# EAGLE design main1 (EAGLE 7.5.0)
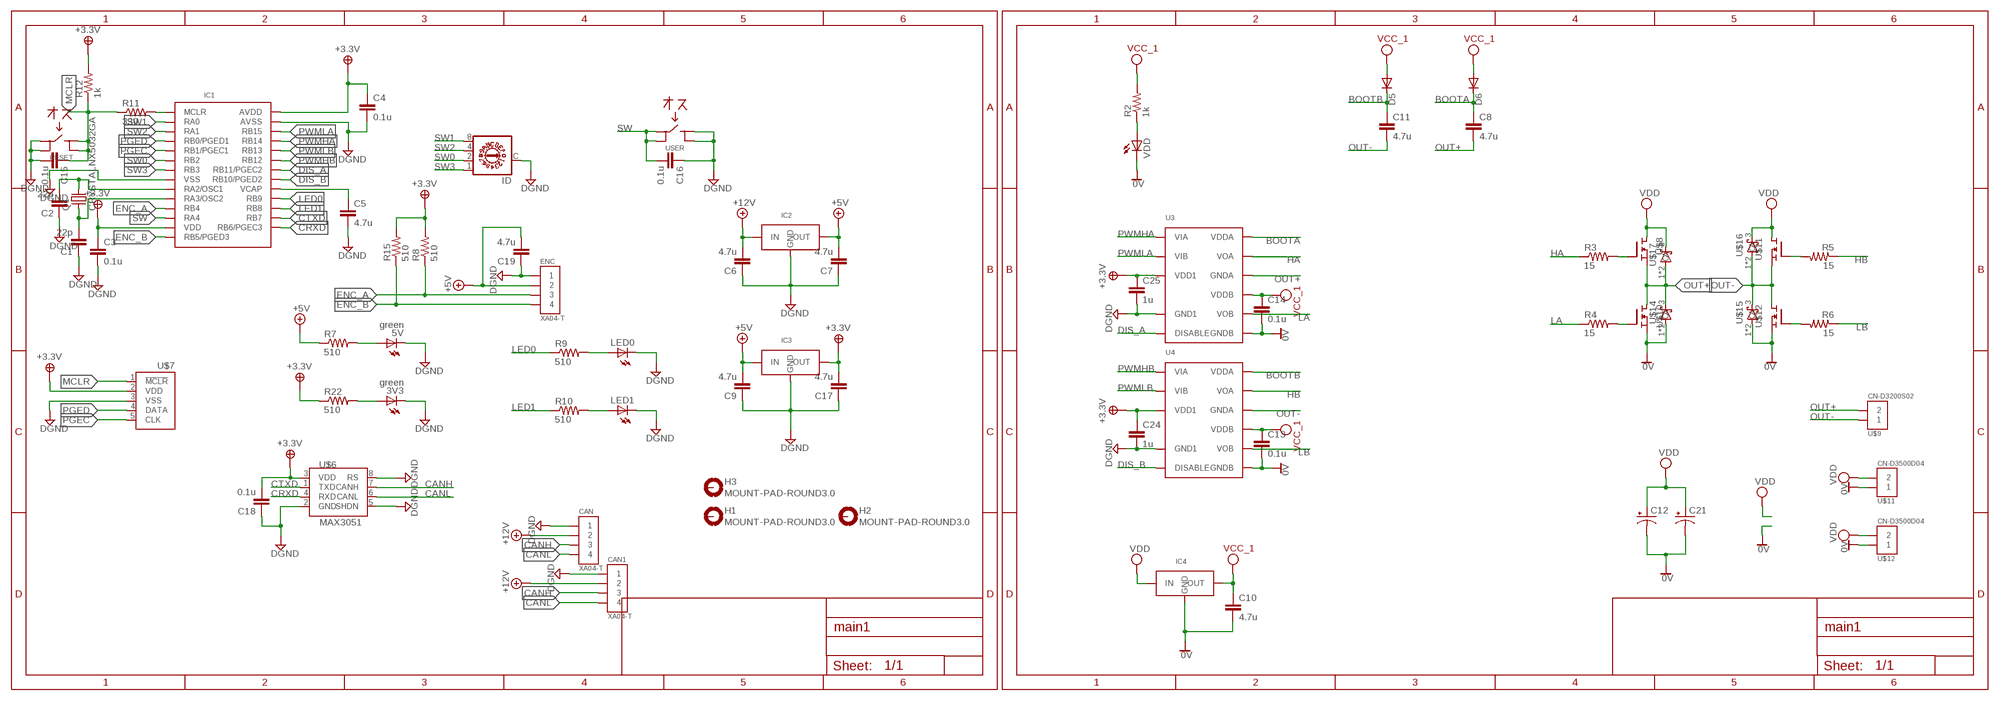
[diagram p0: schematic, sheet 1]

## Parts
3V3  green  LEDCHIPLED_0603  [CHIPLED_0603]
5V  green  LEDCHIPLED_0603  [CHIPLED_0603]
C1  22p  C-EUC0603K  [C0603K]
C2  22p  C-EUC0603K  [C0603K]
C3  0.1u  C-EUC0603K  [C0603K]
C4  0.1u  C-EUC0603K  [C0603K]
C5  4.7u  C-EUC0805K  [C0805K]
C6  4.7u  C-EUC0805K  [C0805K]
C7  4.7u  C-EUC0805K  [C0805K]
C8  4.7u  C-EUC0805K  [C0805K]
C9  4.7u  C-EUC0805K  [C0805K]
C10  4.7u  C-EUC0805K  [C0805K]
C11  4.7u  C-EUC0805K  [C0805K]
C12  CPOL-USG  [PANASONIC_G]
C13  0.1u  C-EUC0805K  [C0805K]
C14  0.1u  C-EUC0805K  [C0805K]
C15  0.1u  C-EUC0603K  [C0603K]
C16  0.1u  C-EUC0603K  [C0603K]
C17  4.7u  C-EUC0805K  [C0805K]
C18  0.1u  C-EUC0603K  [C0603K]
C19  4.7u  C-EUC0805K  [C0805K]
C21  CPOL-USG  [PANASONIC_G]
C24  1u  C-EUC0603K  [C0603K]
C25  1u  C-EUC0603K  [C0603K]
CAN  XA04-T  [XA04]
CAN1  XA04-T  [XA04]
D5  DIODE-SOD123  [SOD123]
D6  DIODE-SOD123  [SOD123]
ENC  XA04-T  [XA04]
H1  MOUNT-PAD-ROUND3.0  [3,0-PAD]
H2  MOUNT-PAD-ROUND3.0  [3,0-PAD]
H3  MOUNT-PAD-ROUND3.0  [3,0-PAD]
IC1  DSPIC33FJ128MC802  [SOIC28]
IC2  REGULATER_MIC39100-5.0WS  REGULATER_MIC39100-3.3WS  [SOT-223]
IC3  REGULATER_AZ1117CR  [SOT89]
IC4  REGULATER_MIC2940A-5.0WU  [TO-263-3]
ID  A1353HEX  [A1353HEX]
LED0  LEDCHIPLED_0603  [CHIPLED_0603]
LED1  LEDCHIPLED_0603  [CHIPLED_0603]
Q1  CRYSTALNX5032GA  [NX5032GA]
R2  1k  R-US_R0603  [R0603]
R3  15  R-US_R2512  [R2512]
R4  15  R-US_R2512  [R2512]
R5  15  R-US_R2512  [R2512]
R6  15  R-US_R2512  [R2512]
R7  510  R-US_R0603  [R0603]
R8  510  R-US_R0603  [R0603]
R9  510  R-US_R0603  [R0603]
R10  510  R-US_R0603  [R0603]
R11  330  R-US_R0603  [R0603]
R12  1k  R-US_R0603  [R0603]
R15  510  R-US_R0603  [R0603]
R22  510  R-US_R0603  [R0603]
RESET  SWITCH_4PALPS  [SKRP]
U3  ADUM3223_SMD  [SOIC16_N]
U4  ADUM3223_SMD  [SOIC16_N]
U$1  CN-D3500D04  [D-3500D04]
U$6  MAX3051  [SOIC8]
U$7  WRITE_FOR_PICT  [ZH05]
U$8  FET_NCH_FMDS86500L  [PQFN_5X6_8L(POWER_56)]
U$9  CN-D3200S02  [D-3200S02-S]
U$10  FET_NCH_FMDS86500L  [PQFN_5X6_8L(POWER_56)]
U$11  FET_NCH_FMDS86500L  [PQFN_5X6_8L(POWER_56)]
U$12  FET_NCH_FMDS86500L  [PQFN_5X6_8L(POWER_56)]
U$14  SCHOTTKY_BARRIER_DIODE_FSV560  [TO-277]
U$15  SCHOTTKY_BARRIER_DIODE_FSV560  [TO-277]
U$16  SCHOTTKY_BARRIER_DIODE_FSV560  [TO-277]
U$17  SCHOTTKY_BARRIER_DIODE_FSV560  [TO-277]
USER  SWITCH_4PALPS  [SKRP]
VDD  LEDCHIPLED_0603  [CHIPLED_0603]

## Nets
0V: C10.2 C12.- C13.2 C14.2 C21.- IC4.2(GND) IC4.PAD(GND) U3.P$9(GNDB) U4.P$9(GNDB) U$1.01A U$1.02A U$10.1(S) U$10.2(S) U$10.3(S) U$12.1(S) U$12.2(S) U$12.3(S) U$14.1(A) U$14.2(A) U$15.1(A) U$15.2(A) VDD.C
3.3V: C3.1 C4.1 C17.2 C18.2 C24.1 C25.1 IC1.13(VDD) IC1.28(AVDD) IC3.2(OUT) IC3.P(OUT) R8.2 R12.2 R15.2 R22.1 U3.P$3(VDD1) U3.P$8(VDD1) U4.P$3(VDD1) U4.P$8(VDD1) U$6.3(VDD) U$7.2(VDD) ; supply symbol labelled +3.3V
+5V: C7.2 C9.2 C19.2 ENC.PIN2 IC2.3(OUT) IC3.3(IN) R7.1
+12V: C6.2 CAN1.PIN2 CAN.PIN2 IC2.1(IN)
BOOTA: C8.1 D6.C U3.P$16(VDDA)
BOOTB: C11.1 D5.C U4.P$16(VDDA)
CANH: CAN1.PIN3 CAN.PIN3 U$6.7(CANH)
CANL: CAN1.PIN4 CAN.PIN4 U$6.6(CANL)
CRXD: IC1.15(RB6/PGEC3) U$6.4(RXD)
CTXD: IC1.16(RB7) U$6.1(TXD)
DGND: 3V3.C 5V.C C1.1 C2.1 C3.2 C4.2 C5.2 C6.1 C7.1 C9.1 C15.2 C16.1 C17.1 C18.1 C19.1 C24.2 C25.2 CAN1.PIN1 CAN.PIN1 ENC.PIN1 IC1.8(VSS) IC1.19(VSS) IC1.27(AVSS) IC2.2(GND) IC2.TAB(GND) IC3.1(GND) ID.C LED0.C LED1.C RESET.1 RESET.2 U3.P$4(GND1) U4.P$4(GND1) U$6.2(GND) U$6.5(SHDN) U$6.8(RS) U$7.3(VSS) USER.3 USER.4
DIS_A: IC1.22(RB11/PGEC2) U3.P$5(DISABLE)
DIS_B: IC1.21(RB10/PGED2) U4.P$5(DISABLE)
ENC_A: ENC.PIN3 IC1.11(RB4) R8.1
ENC_B: ENC.PIN4 IC1.14(RB5/PGED3) R15.1
HA: R3.1 U3.P$15(VOA)
HB: R5.1 U4.P$15(VOA)
LA: R4.1 U3.P$10(VOB)
LB: R6.1 U4.P$10(VOB)
LED0: IC1.18(RB9) R9.1
LED1: IC1.17(RB8) R10.1
MCLR: C15.1 R11.1 R12.1 RESET.3 RESET.4 U$7.1(!MCLR)
N$1: C2.2 IC1.9(RA2/OSC1) Q1.2
N$2: C1.2 IC1.10(RA3/OSC2) Q1.1
N$3: C5.1 IC1.20(VCAP)
N$5: R2.1 VDD.A
N$6: LED0.A R9.2
N$7: LED1.A R10.2
N$8: R3.2 U$8.4(G)
N$9: R4.2 U$10.4(G)
N$10: 5V.A R7.2
N$13: R6.2 U$12.4(G)
N$15: R5.2 U$11.4(G)
N$17: IC1.1(MCLR) R11.2
N$22: 3V3.A R22.2
OUT+: C8.2 U3.P$14(GNDA) U$8.1(S) U$8.2(S) U$8.3(S) U$9.2 U$9.P$2 U$10.5(D) U$10.6(D) U$10.7(D) U$10.8(D) U$10.PAD(D) U$14.3(C) U$17.1(A) U$17.2(A)
OUT-: C11.2 U4.P$14(GNDA) U$9.1 U$9.P$1 U$11.1(S) U$11.2(S) U$11.3(S) U$12.5(D) U$12.6(D) U$12.7(D) U$12.8(D) U$12.PAD(D) U$15.3(C) U$16.1(A) U$16.2(A)
PGEC: IC1.5(RB1/PGEC1) U$7.5(CLK)
PGED: IC1.4(RB0/PGED1) U$7.4(DATA)
PWMHA: IC1.25(RB14) U3.P$1(VIA)
PWMHB: IC1.23(RB12) U4.P$1(VIA)
PWMLA: IC1.26(RB15) U3.P$2(VIB)
PWMLB: IC1.24(RB13) U4.P$2(VIB)
SW: C16.2 IC1.12(RA4) USER.1 USER.2
SW0: IC1.6(RB2) ID.2
SW1: IC1.2(RA0) ID.8
SW2: IC1.3(RA1) ID.4
SW3: IC1.7(RB3) ID.1
VCC_1: C10.1 C13.1 C14.1 D5.A D6.A IC4.3(OUT) R2.2 U3.P$11(VDDB) U4.P$11(VDDB)
VDD: C12.+ C21.+ IC4.1(IN) U$1.01B U$1.02B U$8.5(D) U$8.6(D) U$8.7(D) U$8.8(D) U$8.PAD(D) U$11.5(D) U$11.6(D) U$11.7(D) U$11.8(D) U$11.PAD(D) U$16.3(C) U$17.3(C)
Unconnected: H1.B3,0(MOUNT) H2.B3,0(MOUNT) H3.B3,0(MOUNT)

## Library data of the parts
3V3 5V LED0 LED1 VDD = led:LED: LED OSRAM: - CHIPLED LG R971, LG N971, LY N971, LG Q971, LY Q971, LO R971, LY R971 LH N974, LH R974 LS Q976, LO Q976, LY Q976 LO Q996 - Hyper CHIPLED LW Q18S LB Q993, LB Q99A, LB R99A - SideLED LS A670, LO A670, LY A670, LG A670, LP A670 LB A673, LV A673, LT A673, LW A673 LH A674 LY A675 LS A676, LA A676, LO A676, LY A676, LW A676 LS A679, LY A679, LG A679 - Hyper Micro SIDELED® LS Y876, LA Y876, LO Y876, LY Y876 LT Y87S - SmartLED LW L88C, LW L88S LB L89C, LB L89S, LG L890 LS L89K, LO L89K, LY L89K LS L896, LA L896, LO L896, LY L896 - TOPLED LS T670, LO T670, LY T670, LG T670, LP T670 LSG T670, LSP T670, LSY T670, LOP T670, LYG T670 LG T671, LOG T671, LSG T671 LB T673, LV T673, LT T673, LW T673 LH T674 LS T676, LA T676, LO T676, LY T676, LB T676, LH T676, LSB T676, LW T676 LB T67C, LV T67C, LT T67C, LS T67K, LO T67K, LY T67K, LW E67C LS E67B, LA E67B, LO E67B, LY E67B, LB E67C, LV E67C, LT E67C LW T67C LS T679, LY T679, LG T679 LS T770, LO T770, LY T770, LG T770, LP T770 LB T773, LV T773, LT T773, LW T773 LH T774 LS E675, LA E675, LY E675, LS T675 LS T776, LA T776, LO T776, LY T776, LB T776 LHGB T686 LT T68C, LB T68C - Hyper Mini TOPLED® LB M676 - Mini TOPLED Santana® LG M470 LS M47K, LO M47K, LY M47K Source: http://www.osram.convergy.de LUXEON: - LUMILED® LXK2-PW12-R00, LXK2-PW12-S00, LXK2-PW14-U00, LXK2-PW14-V00 LXK2-PM12-R00, LXK2-PM12-S00, LXK2-PM14-U00 LXK2-PE12-Q00, LXK2-PE12-R00, LXK2-PE12-S00, LXK2-PE14-T00, LXK2-PE14-U00 LXK2-PB12-K00, LXK2-PB12-L00, LXK2-PB12-M00, LXK2-PB14-N00, LXK2-PB14-P00, LXK2-PB14-Q00 LXK2-PR12-L00, LXK2-PR12-M00, LXK2-PR14-Q00, LXK2-PR14-R00 LXK2-PD12-Q00, LXK2-PD12-R00, LXK2-PD12-S00 LXK2-PH12-R00, LXK2-PH12-S00 LXK2-PL12-P00, LXK2-PL12-Q00, LXK2-PL12-R00 Source: www.luxeon.com KINGBRIGHT: KA-3528ASYC Source: www.kingbright.com
C1-C11 C13-C19 C24 C25 = rp_c:C-EU: CAPACITOR, European symbol
C12 C21 = rcl:CPOL-US: POLARIZED CAPACITOR, American symbol
CAN CAN1 ENC = rp_cn_xa:XA04
D5 D6 = diode:DIODE-: DIODE
H1-H3 = Shohei:MOUNT-PAD-ROUND: MOUNTING PAD, round
IC1 = Syohei:DSPIC33FJ128MC802
IC2-IC4 = Shohei:REGULATER
ID = switch-dil:A1353HEX: DIL/CODE SWITCH; OC_FARNELL: unknown; OC_NEWARK: unknown
Q1 = Shohei:CRYSTAL
R2-R12 R15 R22 = rp_r:R-US_: RESISTOR, American symbol
RESET USER = Syohei:SWITCH_4P
U3 U4 = Shohei:ADUM3223
U$1 = Syohei:CN-D3500D04
U$6 = Syohei:MAX3051
U$7 = Syohei:WRITE_FOR_PIC
U$8 U$10-U$12 = Shohei:FET_NCH
U$9 = Syohei:CN-D3200S02
U$14-U$17 = Shohei:SCHOTTKY_BARRIER_DIODE

## Board
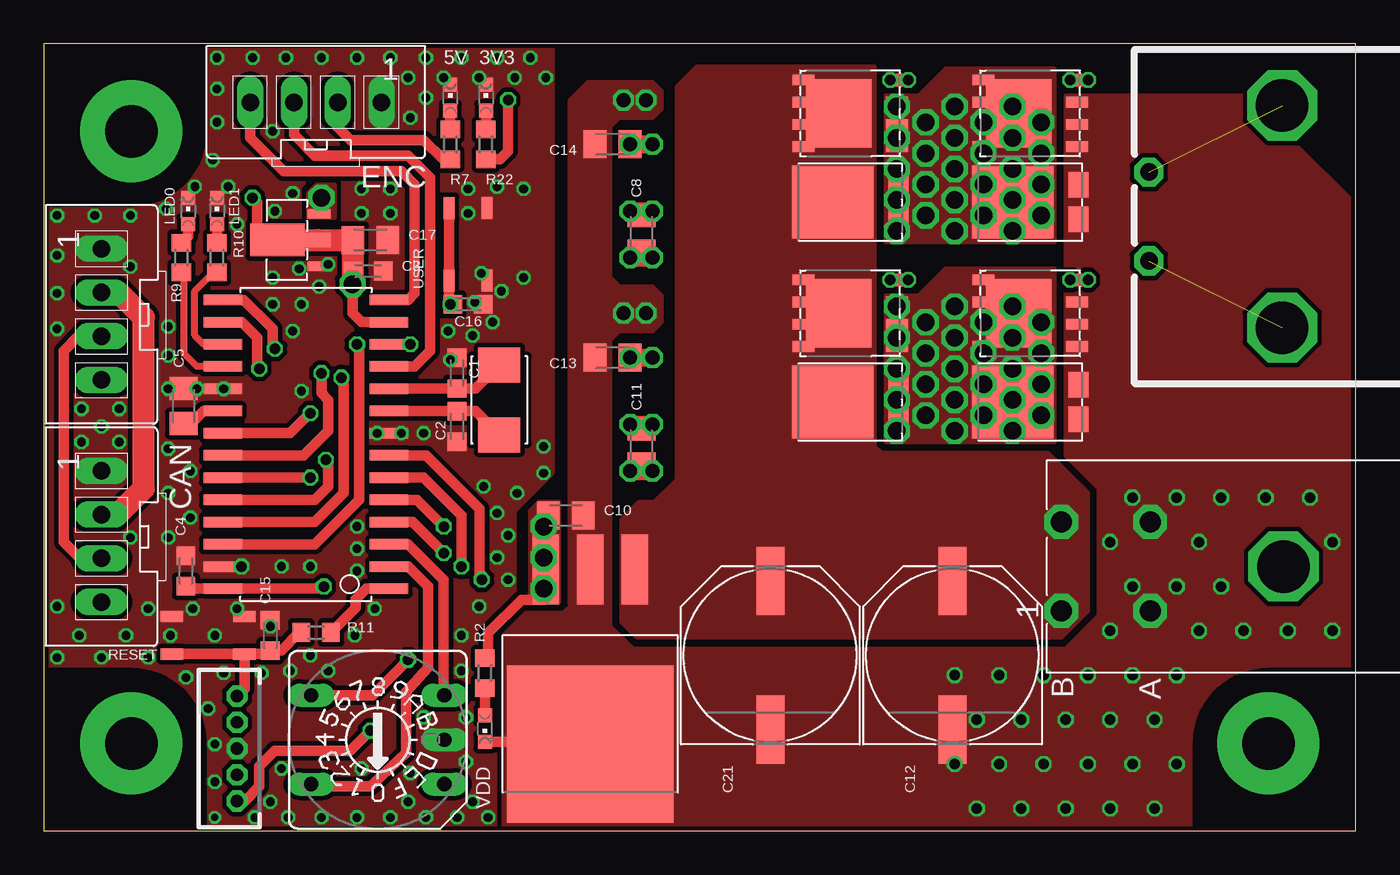
[diagram p1: board, top side]
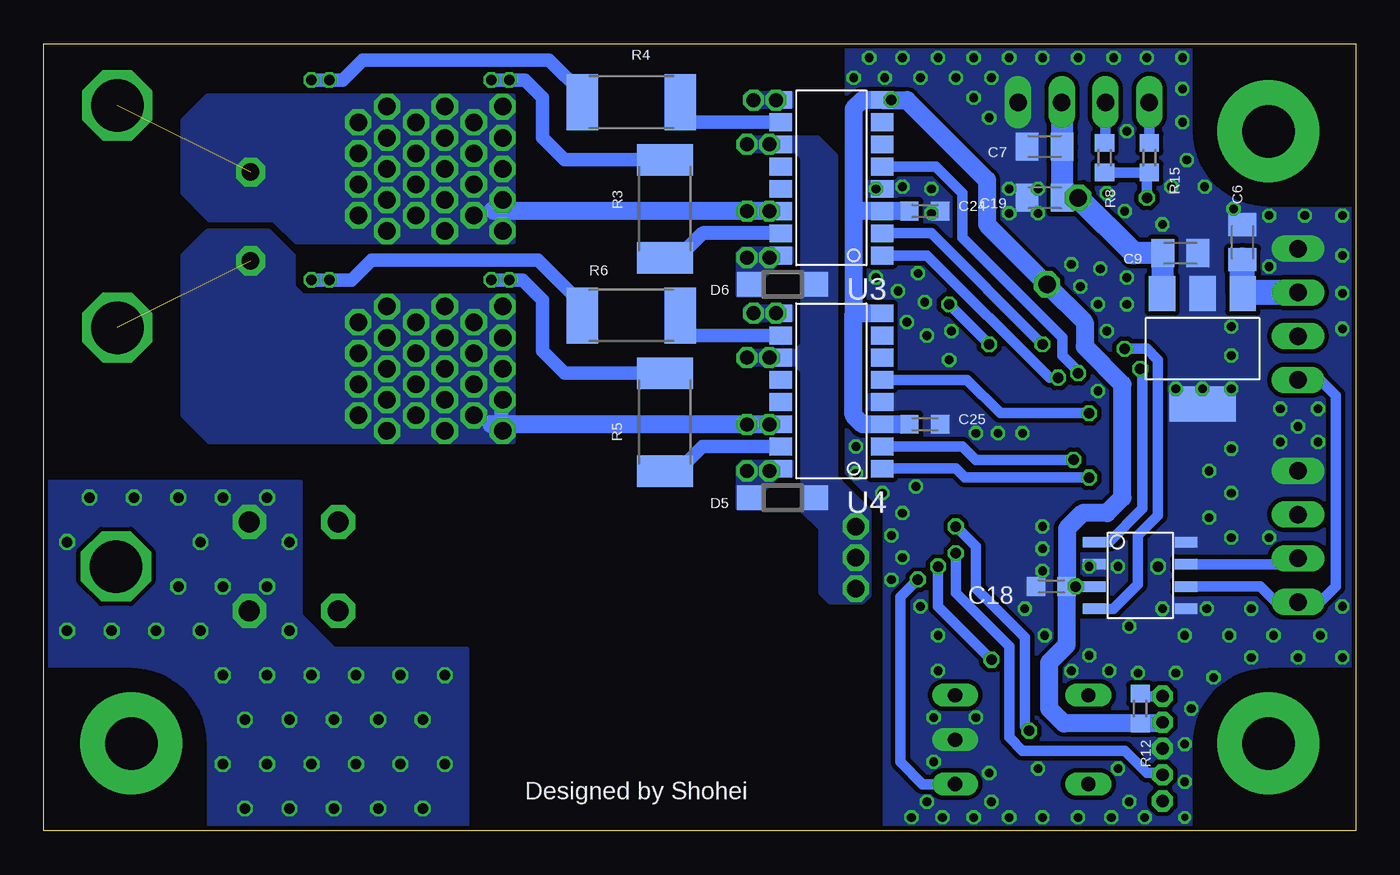
[diagram p2: board, bottom side, seen from below]

Size 75 x 45 mm. Coordinates in mm from the lower left corner, seen from the top.
Outline: 0,0 75,0 75,45 0,45 0,0
Copper layers (1*16): Top 0.035mm / dielectric 1.5mm / Bottom 0.035mm
Design rules "Elecrow_2-layer_eagle_rule": minimum track width 6mil, minimum drill 12mil, track to track 6mil, track to pad 6mil, pad to pad 6mil, via to via 6mil, smd to smd 0mil, copper to edge 10mil, drill to drill 10mil, minimum pad ring 10mil, minimum via ring 6mil, stop-mask expansion 2mil, vias tented up to drill 100mil, thermal gap 10mil
tRestrict: 1 lines

### Footprints (pad centres in the part's own frame; a part is rotated, then mirrored left to right if it is on the bottom)
CHIPLED_0603 = smd 0.8 x 0.8: A 0,-0.75; C 0,0.75
C0603K = smd 1.05 x 1.08: 1 -0.875,0; 2 0.875,0
C0805K = smd 1.3 x 1.6: 1 -1,0; 2 1,0
PANASONIC_G = smd 3.9 x 1.6: + 4.25,0; - -4.25,0
XA04 = drill 1 long: PIN1 0,0; PIN2 -2.5,0; PIN3 -5,0; PIN4 -7.5,0
SOD123 = smd 1.4 x 1.4: A 1.9,0; C -1.9,0
3,0-PAD = drill 3 pad 5.842: B3,0 0,0
SOIC28 = smd 0.6 x 2.2: 1 -8.255,-4.75; 2 -6.985,-4.75; 3 -5.715,-4.75; 4 -4.445,-4.75; 5 -3.175,-4.75; 6 -1.905,-4.75; 7 -0.635,-4.75; 8 0.635,-4.75; 9 1.905,-4.75; 10 3.175,-4.75; 11 4.445,-4.75; 12 5.715,-4.75; 13 6.985,-4.75; 14 8.255,-4.75; 15 8.255,4.75; 16 6.985,4.75; 17 5.715,4.75; 18 4.445,4.75; 19 3.175,4.75; 20 1.905,4.75; 21 0.635,4.75; 22 -0.635,4.75; 23 -1.905,4.75; 24 -3.175,4.75; 25 -4.445,4.75; 26 -5.715,4.75; 27 -6.985,4.75; 28 -8.255,4.75
SOT-223 = smd 1.499 x 2.007: 1 -2.311,-3.15; 2 0,-3.15; 3 2.311,-3.15 | smd 3.81 x 2.007: TAB 0,3.15
SOT89 = smd 0.55 x 1.3: 1 -1.5,0; 3 1.5,0 | smd 0.8 x 1.475: 2 0,0.087 | smd 1.85 x 3.125: P 0,2.388
TO-263-3 = smd 1.5 x 4: 1 -2.54,0; 2 0,0; 3 2.54,0 | smd 9.5 x 9: PAD 0,10
A1353HEX = drill 0.813 long: 1 3.81,-2.54; 2 -3.81,2.54; 4 3.81,2.54; 8 -3.81,-2.54; C 3.81,0
NX5032GA = smd 2 x 2.4: 1 -2,0; 2 2,0
R0603 = smd 1 x 1.1: 1 -0.85,0; 2 0.85,0
R2512 = smd 1.8 x 3.2: 1 -2.8,0; 2 2.8,0
SKRP = smd 1.27 x 0.635: 1 -2.075,1.075; 2 2.075,1.075; 3 -2.075,-1.075; 4 2.075,-1.075
SOIC16_N = smd 1.016 x 1.27: P$1 -4.445,-2.9; P$2 -3.175,-2.9; P$3 -1.905,-2.9; P$4 -0.635,-2.9; P$5 0.635,-2.9; P$6 1.905,-2.9; P$7 3.175,-2.9; P$8 4.445,-2.9; P$9 4.445,2.9; P$10 3.175,2.9; P$11 1.905,2.9; P$12 0.635,2.9; P$13 -0.635,2.9; P$14 -1.905,2.9; P$15 -3.175,2.9; P$16 -4.445,2.9
D-3500D04 = drill 1.2 pad 1.93 octagon: 01A -2.54,-5.08; 01B -2.54,0; 02A 2.54,-5.08; 02B 2.54,0 | drill 3 pad 4 octagon: P$1 0,-12.7
SOIC8 = smd 0.6 x 1.3: 1 -1.905,-2.625; 2 -0.635,-2.625; 3 0.635,-2.625; 4 1.905,-2.625; 5 1.905,2.625; 6 0.635,2.625; 7 -0.635,2.625; 8 -1.905,2.625
ZH05 = drill 0.7 octagon: 1 3,0; 2 1.5,0; 3 0,0; 4 -1.5,0; 5 -3,0
PQFN_5X6_8L(POWER_56) = smd 0.61 x 1.27: 1 -1.905,-2.67; 2 -0.635,-2.67; 3 0.635,-2.67; 4 1.905,-2.67; 5 1.905,2.67; 6 0.635,2.67; 7 -0.635,2.67; 8 -1.905,2.67 | smd 3.91 x 3.75: PAD 0,0.66
D-3200S02-S = drill 1 pad 1.676 octagon: 1 -2.6,21.28; 2 2.48,21.28 | drill 3 pad 4 octagon: P$1 -6.41,13.66; P$2 6.29,13.66
TO-277 = smd 1.15 x 1.45: 1 2.75,0.985; 2 2.75,-0.985 | smd 4.65 x 4.15: 3 -1,0

### Placement (x,y rotation side)
3V3  25.27,41.91 0 top
5V  23.24,41.91 0 top
C1  23.62,26.16 270 top
C2  23.62,23.11 90 top
C3  18.54,32 0 top
C4  8.13,14.86 90 top
C5  8,24.29 90 top
C6  6.48,33.66 270 bottom
C7  17.78,39.12 0 bottom
C8  34.16,34.16 90 top
C9  10.03,33.02 180 bottom
C10  29.84,18.03 0 top
C11  34.16,21.97 90 top
C12  51.94,10.03 90 top
C13  32.51,27.05 180 top
C14  32.51,39.24 180 top
C15  12.95,11.18 90 top
C16  24.26,30.1 180 top
C17  18.67,33.78 180 top
C18  17.4,13.97 0 bottom
C19  17.78,36.2 0 bottom
C21  41.53,10.03 90 top
C24  24.64,35.43 0 bottom
C25  24.64,23.24 0 bottom
CAN  3.3,20.57 90 top
CAN1  3.3,33.27 90 top
D5  32.77,19.05 0 bottom
D6  32.77,31.24 0 bottom
ENC  19.3,41.66 0 top
H1  5,40 0 top
H2  5,5 0 top
H3  70,5 0 top
IC1  14.99,22.1 90 top
IC2  8.76,27.56 180 bottom
IC3  15.75,33.78 90 top
IC4  31.24,14.95 180 top
ID  19.1,5.21 0 top
LED0  8.26,35.43 0 top
LED1  9.91,35.43 0 top
Q1  26.04,24.64 270 top
R2  25.22,9.02 90 top
R3  39.5,35.56 90 bottom
R4  41.4,41.66 180 bottom
R5  39.5,23.37 90 bottom
R6  41.4,29.46 180 bottom
R7  23.24,39.24 90 top
R8  14.35,38.48 270 bottom
R9  7.87,32.77 90 top
R10  9.91,32.77 90 top
R11  15.57,11.34 0 top
R12  12.32,6.99 270 bottom
R15  11.8,38.48 270 bottom
R22  25.27,39.24 90 top
RESET  9.4,11.18 0 top
U3  29.97,37.34 90 bottom
U4  29.97,25.15 90 bottom
U$1  58.17,15.11 90 top
U$6  12.32,14.61 270 bottom
U$7  11.05,4.7 90 top
U$8  46.1,41.02 90 top
U$9  84.45,35.18 90 top
U$10  56.39,41.02 90 top
U$11  46.1,29.59 90 top
U$12  56.39,29.59 90 top
U$14  56.39,35.94 0 top
U$15  56.39,24.51 0 top
U$16  46.1,24.51 0 top
U$17  46.1,35.94 0 top
USER  24.26,33.53 90 top
VDD  25.22,5.84 180 top

### Tracks (layer width: path | path; a pad name or v marks a point on that pad's centre or on a via)
0V  (via drill 0.6, 0.8)
  Top 0.61: VDD.C 25.23,5.08 27.05,5.08
  other vias: 34.42,29.59 33.15,29.59 34.42,41.78 33.15,41.78 63.5,1.27 60.96,1.27 59.69,3.81 62.23,3.81 64.77,3.81 63.5,6.35 60.96,6.35 62.23,8.89 60.96,11.43 59.69,8.89 64.77,8.89 66.04,11.43 64.77,13.97 67.31,13.97 68.58,11.43 71.12,11.43 73.66,11.43 66.04,16.51 67.31,19.05 69.85,19.05 72.39,19.05 64.77,19.05 60.96,16.51 73.66,16.51 58.42,1.27 55.88,1.27 53.34,1.27 57.15,3.81 54.61,3.81 53.34,6.35 52.07,3.81 52.07,8.89 54.61,8.89 57.15,8.89 55.88,6.35 58.42,6.35 62.23,13.97 62.23,19.05
  pour Top (isolate 0.254, rank 4, no thermals): 26.29,10.41 26.29,0 75.06,0 75.06,42.04 58.42,42.04 58.42,21.46 60.33,19.56 60.33,12.32 58.42,10.41
  pour Bottom (isolate 0.254, rank 3, no thermals): 32.26,29.97 34.8,29.97 34.92,29.84 34.92,29.34 34.8,29.21 32.26,29.21
  pour Bottom (isolate 0.254, rank 3, no thermals): 32.26,42.16 34.8,42.16 34.92,42.04 34.92,41.53 34.8,41.4 32.26,41.4
  pour Top (isolate 0.254, rank 3, no thermals): 30.1,9.53 30.1,41.78 31.11,42.8 34.8,42.8 35.31,42.29 35.31,41.27 34.8,40.77 32.89,40.77 32.38,40.26 32.38,31.62 32.89,31.11 34.8,31.11 35.31,30.61 35.31,29.08 34.8,28.57 32.89,28.57 32.38,28.07 32.38,9.4 30.23,9.4
  pour Top (isolate 0.254, rank 4, no thermals): 35.31,10.16 33.91,10.16 31.75,12.32 31.75,12.95 30.23,12.95 29.72,12.45 27.56,12.45 26.29,11.18 26.29,9.78 27.18,8.89 35.31,8.89
  pour Bottom (isolate 0.254, rank 4, no thermals): 60.33,12.32 58.42,10.41 58.42,0 75.06,0 75.06,19.43 60.33,19.43
  pour Bottom (isolate 0.254, rank 4): 58.42,10.41 50.8,10.41 50.8,0 58.42,0
  pour Bottom (isolate 0.254, rank 4, no thermals): 60.33,12.32 58.42,10.41 58.42,0.76 75.06,0.76 75.06,19.94 60.33,19.94
3.3V  (via drill 0.6, 1)
  Top 0.61: IC1.13 18.16,29.08 17.65,29.59 v17.65,31.24 17.65,31.99 C3.1 | IC3.P 12.83,33.78 12.83,33.91 12.19,34.54 12.19,35.94 v11.94,36.2 | C4.1 8.24,13.84 IC1.28 15.88,13.84 v16,13.97 | R22.1 26.07,38.39 26.54,38.86 v26.54,41.78
  Top 1.016: 17.65,32.02 C3.1 | C17.2 17.65,33.78
  Top 1.27: IC3.P IC3.2 17.65,33.78 | C17.2 17.65,33.77 v17.65,31.24
  Bottom 0.61: R8.2 R15.2 11.94,37.62 v11.94,36.2 | C18.2 v16,13.97 U$6.3
  Bottom 0.813: 16.51,14.46 C18.2
  Bottom 1.016: C18.2 16.52,10.62 17.53,9.62 17.53,6.99 16.68,6.13 R12.2 11.11,6.13 U$7.2 | 28.7,29.59 28.7,23.75 28.19,23.24 U4.P$3 C25.1 | 28.7,29.59 U4.P$8 | 28.7,35.43 U3.P$3 C24.1 | 28.7,35.43 28.7,29.59 | 28.7,35.43 28.7,41.27 28.19,41.78 U3.P$8 v26.54,41.78 25.65,41.78 21.08,37.21 21.08,34.67 v17.65,31.24 15.49,29.08 15.49,27.69 13.34,25.53 13.34,19.05 14.22,18.16 15.62,18.16 16.51,17.27 16.51,14.46
+5V  (via drill 1)
  Top 0.61: R7.1 22.82,38.39 21.72,39.5 17.54,39.5 16.78,40.26 16.78,41.63 ENC.PIN2
  Bottom 0.61: C19.2
  Bottom 1.27: 11.02,30.71 IC2.3 11.03,30.75 C9.2 12.7,33.02 v15.88,36.2 C19.2 | C7.2 16.78,41.63 ENC.PIN2 | 16.76,39.1 C7.2 | C19.2 C7.2
  pour Top (isolate 0.254, rank 4, no thermals): 16.64,35.05 15.11,35.05 15.11,36.45 15.62,36.96 16.64,36.96
+12V
  Top 1.27: CAN.PIN2 4.23,18.07 5.71,19.56 5.71,29.35 4.29,30.77 CAN1.PIN2
  Bottom 1.27: IC2.1 6.48,30.73
  Bottom 1.422: CAN1.PIN2 6.39,30.77 IC2.1 | 6.48,30.73 C6.2
BOOTA  (via drill 0.8)
  Top 1.016: C8.1 33.54,32.77 v34.8,32.77
  other vias: 33.53,32.77
  pour Bottom (isolate 0.254, no thermals): 32.26,32.51 33.02,32.51 34.04,31.5 34.04,30.61 35.31,30.61 35.31,33.02 35.05,33.27 32.26,33.27
BOOTB  (via drill 0.8)
  Top 1.016: C11.1 33.54,20.57 v34.8,20.57
  other vias: 33.53,20.57
  pour Bottom (isolate 0.254, no thermals): 32.26,20.32 33.02,20.32 34.04,19.3 34.04,18.41 35.31,18.41 35.31,20.83 35.05,21.08 32.26,21.08
CANH
  Top 0.61: CAN.PIN3 2.08,15.57 1.14,16.51 1.14,27.43 1.99,28.27 CAN1.PIN3
  Bottom 0.61: CAN.PIN3 3.64,15.24 U$6.7
CANL
  Bottom 0.61: U$6.6 5.46,13.97 4.57,13.08 CAN.PIN4 2.04,13.07 1.14,13.97 1.14,24.89 2.02,25.77 CAN1.PIN4
CRXD  (via drill 0.6)
  Top 0.61: IC1.15 11.43,30.35 13.08,28.7 13.08,27.69 v13.21,27.56
  Bottom 0.61: U$6.4 13.84,12.7 12.45,14.1 12.45,16.89 11.3,18.03 11.3,26.92 11.94,27.56 v13.21,27.56
CTXD  (via drill 0.6)
  Top 0.61: v12.32,26.42 12.19,26.54 12.19,28.19 11.3,29.08 IC1.16
  Bottom 0.61: U$6.1 14.1,16.51 12.19,18.41 12.19,26.29 v12.32,26.42
DGND  (via drill 0.4, 0.5, 0.6)
  other vias: 0.76,9.91 3.3,9.91 9.91,44.2 9.91,42.42 9.65,38.35 11.94,44.2 13.84,44.2 19.81,44.2 21.84,44.2 23.88,44.2 27.81,44.2 27.43,36.7 27.43,31.62 25.02,31.88 24.64,30.23 24.51,28.32 21.72,22.73 19.05,22.73 15.88,0.76 17.91,0.76 21.84,0.76 19.81,0.76 2.16,24.13 2.16,22.23 4.32,22.23 4.32,24.13 7.11,21.84 7.11,16.76 8.38,17.91 5.97,12.7 0.76,12.83 0.76,30.73 0.76,32.89 0.76,35.18 2.92,35.18 4.95,35.18 6.99,35.56 0.76,28.7 7.11,28.83 14.61,32.13 7.11,27.18 19.81,36.7 19.81,35.31 17.91,17.4 11.3,15.11 17.91,14.86 13.59,15.11 15.24,15.11 11.05,12.7 8.51,12.7 7.24,11.18 9.78,11.18 5.97,9.91 8.13,8.76 9.78,0.76 13.97,0.76 25.91,44.2 25.91,36.83 25.4,0.76 23.62,0.76 16.26,9.14 21.84,41.91 8.76,25.27 10.29,25.27 8.64,36.83 20.45,22.73 26.16,30.86 25.65,29.08 13.08,31.62 7.11,19.3 2.03,11.18 4.7,11.18 16.26,32.38 11.05,34.67 8.38,20.57 18.16,36.7 13.08,40.01 23.11,28.57 14.73,25.15 17.91,16.13 9.78,4.95 10.29,9.02 7.11,25.27 14.22,28.57 15.75,31.11 14.22,36.45 9.78,2.79 9.4,6.99 12.06,0.76 18.92,12.7 20.95,3.3 23.88,9.14 24.89,12.83 26.54,14.35 27.05,19.3 25.91,18.16 26.54,16.89 25.91,15.62 17.78,11.18 12.95,11.68 12.45,9.02 13.59,3.56 18.16,3.56 21.72,6.48 24.13,6.48 23.88,11.18 4.95,16.76 14.1,9.14 15.24,10.03 14.73,30.1 13.21,35.43 22.86,43.05 9.91,40.51 18.16,35.31 4.95,32.26 3.3,23.11 10.54,36.83 15.88,44.2 26.92,43.05 24.89,43.05 28.57,21.97 28.57,20.45 28.7,43.05 17.91,44.2 20.83,43.05 20.95,40.77 23.24,26.92 24.26,35.31 25.15,19.68 13.08,30.1 24.26,36.7 12.95,1.65 20.83,1.65 24.13,3.94 24.51,1.65
  pour Bottom (isolate 0.254, rank 6, no thermals): 0,0 0,45 29.08,45 29.08,20.45 26.92,18.29 26.92,0
  pour Top (isolate 0.254, rank 6, no thermals): 0,0 0,45 29.08,45 29.08,20.45 26.92,18.29 26.92,0
DIS_A  (via drill 0.6)
  Top 0.61: IC1.22 14.86,21.46 16.26,22.86 16.26,24.64 15.88,25.02 v15.88,26.16
  Bottom 0.61: v15.88,26.16 15.88,26.29 16.76,27.18 16.76,28.19 22.48,33.91 22.48,36.45 24,37.97 U3.P$5
DIS_B  (via drill 0.6)
  Top 0.61: IC1.21 14.1,22.73 v15.24,23.88
  Bottom 0.61: v15.24,23.88 20.32,23.88 22.23,25.78 U4.P$5
ENC_A
  Top 0.61: IC1.11 21.21,26.54 22.1,27.43 22.1,37.34 20.83,38.61 15.49,38.61 14.3,39.8 ENC.PIN3
  Bottom 0.61: R8.1 14.3,39.38 ENC.PIN3
ENC_B
  Top 0.61: ENC.PIN4 11.8,39.63 13.72,37.72 20.45,37.72 21.21,36.96 21.21,30.73 20.83,30.35 IC1.14
  Bottom 0.61: R15.1 ENC.PIN4
HA
  Bottom 0.813: U3.P$15 37.34,34.16 38.74,32.76 R3.1
HB
  Bottom 0.762: U4.P$15 37.34,21.97 38.87,20.44
  Bottom 0.813: 38.87,20.44 R5.1
LA
  Bottom 0.762: U3.P$10 38.6,40.51 R4.1
LB
  Bottom 0.762: 38.6,29.59 R6.1 38.22,29.08 38.22,28.32 U4.P$10
LED0
  Top 0.406: IC1.18 8.76,26.54 8,27.3 8,31.79 R9.1
LED1
  Top 0.406: IC1.17 9.14,27.81 8.64,28.32 8.64,30.86 9.53,31.75 9.74,31.75 R10.1
MCLR
  Top 0.61: RESET.4 12.88,10.1 C15.1 12.98,10.33 13.59,10.33 14.6,11.34 R11.1 | RESET.3 RESET.4 | U$7.1 11.47,8.12 RESET.4
  Bottom 0.61: R12.1 12.18,7.7 U$7.1
N$1
  Top 0.61: IC1.9 23.48,24 C2.2 24.68,23.99 Q1.2
N$2
  Top 0.61: IC1.10 23.61,25.27 C1.2 24.68,25.29 Q1.1
N$3
  Top 0.61: C5.1 8.43,23.29 9.14,24 IC1.20
N$5
  Top 0.61: R2.1 VDD.A
N$6
  Top 0.61: R9.2 8.26,34 LED0.A
N$7
  Top 0.61: R10.2 LED1.A
N$8  (via drill 0.6)
  Top 0.762: v49.4,42.93 U$8.4 v48.39,42.93
  Bottom 0.762: v49.4,42.93 47.5,42.93 46.48,41.91 46.48,39.62 45.22,38.36 R3.2
N$9  (via drill 0.6)
  Top 0.762: v58.67,42.93 U$10.4 v59.69,42.93
  Bottom 0.762: R4.2 44.2,42.17 46.1,44.07 56.77,44.07 57.91,42.93 v58.67,42.93 v59.69,42.93
N$10
  Top 0.61: R7.2 5V.A
N$11
  cutout Top: 0,0 9.2,0 9.2,5 arc90 5,9.2 0,9.2
  cutout Bottom: 0,0 0,9.2 5,9.2 arc-90 9.2,5 9.2,0
  cutout Bottom: 0,45 9.2,45 9.2,40 arc-90 5,35.8 0,35.8
  cutout Top: 0,45 0,35.8 5,35.8 arc90 9.2,40 9.2,45
  cutout Top: 75,0 75,9.2 70,9.2 arc90 65.8,5 65.8,0
  cutout Bottom: 75,0 65.8,0 65.8,5 arc-90 70,9.2 75,9.2
N$13  (via drill 0.6)
  Top 0.762: v59.69,31.5 U$12.4 v58.67,31.5
  Bottom 0.762: R6.2 44.7,29.97 44.7,30.61 46.74,32.64 56.26,32.64 57.4,31.5 v59.69,31.5
N$15  (via drill 0.6)
  Top 0.762: v49.4,31.5 U$11.4 v48.39,31.5
  Bottom 0.762: v49.4,31.5 47.62,31.5 46.48,30.35 46.48,27.43 45.22,26.17 R5.2
N$17
  Top 0.61: IC1.1 18.44,13.84 17.83,13.23 17.83,12.75 16.8,11.72 R11.2
N$22
  Top 0.61: R22.2 3V3.A
OUT+  (via drill 0.8, 1)  (1 unrouted)
  Top 0.813: C8.2 v33.53,35.43
  Top 1.016: v33.53,35.43 v34.8,35.43
  Bottom 0.813: 49.28,35.43 49.4,35.56 | v33.53,35.43 U3.P$14
  Bottom 1.016: 49.28,35.43 v34.8,35.43 v33.53,35.43
  other vias: 48.77,34.29 48.77,36.07 48.77,37.85 48.77,39.62 48.77,41.4 50.42,35.18 50.42,36.96 50.42,38.73 50.42,40.51 52.07,36.07 52.07,37.85 52.07,39.62 53.72,38.73 53.72,36.96 55.37,37.85 52.07,34.29 53.72,35.18 55.37,36.07 55.37,34.29 57.02,35.18 57.02,36.96 52.07,41.4 53.72,40.51 55.37,39.62 57.02,38.73 55.37,41.4 57.02,40.51
  pour Top (isolate 0.254, no thermals): 48.13,42.04 50.04,42.04 51.56,43.56 57.78,43.56 57.78,33.66 48.13,33.66
  pour Bottom (isolate 0.254, no thermals): 48.13,33.66 60.58,33.66 61.85,34.92 65.53,34.92 67.06,36.45 67.06,40.64 65.66,42.04 48.13,42.04
OUT-  (via drill 0.8, 1)  (1 unrouted)
  Top 0.813: C11.2 v33.53,23.24
  Top 1.016: v33.53,23.24 v34.8,23.24
  Bottom 0.813: 48.85,24 U$16.2 | 49.4,23.24 49.53,23.37 | v33.53,23.24 U4.P$14
  Bottom 1.016: v33.53,23.24 v34.8,23.24 49.4,23.24
  other vias: 48.77,29.97 48.77,28.19 48.77,26.42 48.77,24.64 48.77,22.86 50.42,23.75 50.42,25.53 50.42,27.3 50.42,29.08 52.07,29.97 52.07,28.19 53.72,29.08 55.37,29.97 55.37,28.19 57.02,29.08 52.07,26.42 52.07,24.64 52.07,22.86 53.72,27.3 53.72,25.53 53.72,23.75 55.37,26.42 55.37,24.64 55.37,22.86 57.02,23.75 57.02,25.53 57.02,27.3
  pour Top (isolate 0.254, no thermals): 48.13,30.61 50.04,30.61 51.56,32.13 57.78,32.13 57.78,22.23 48.13,22.23
  pour Bottom (isolate 0.254, rank 2, no thermals): 48.13,22.23 48.13,30.61 60.2,30.61 60.71,31.11 60.71,32.89 62.1,34.29 65.66,34.29 67.06,32.89 67.06,23.75 65.53,22.23
PGEC  (via drill 0.6)
  Top 0.61: v22.86,17.4 21.34,18.92 IC1.5 | v18.67,5.71 17.53,4.57 13.21,4.57 12.32,3.68 12.32,2.54 11.48,1.7 U$7.5
  Bottom 0.61: v22.86,17.4 21.72,16.26 21.72,13.84 18.92,11.05 18.92,5.97 v18.67,5.71
PGED  (via drill 0.6)
  Top 0.61: IC1.4 21.08,17.65 v22.86,15.88
  Bottom 0.61: v22.86,15.88 22.86,13.59 19.81,10.54 19.81,5.33 19.05,4.57 13.21,4.57 11.94,3.3 11.15,3.3 U$7.4
PWMHA  (via drill 0.6)
  Top 0.61: IC1.25 15.49,17.65 17.14,19.3 17.14,25.78 v17.02,25.91
  Bottom 0.61: v17.02,25.91 17.53,25.91 24.51,32.89 U3.P$1
PWMHB  (via drill 0.6)
  Top 0.61: IC1.23 v15.24,20.19
  Bottom 0.61: U4.P$1 22.86,20.7 22.35,20.19 v15.24,20.19
PWMLA  (via drill 0.6)
  Top 0.61: IC1.26 15.49,16.38 18.03,18.92 18.03,27.69 v17.91,27.81
  Bottom 0.61: U3.P$2 24.26,34.16 v17.91,27.81
PWMLB  (via drill 0.6)
  Top 0.61: IC1.24 15.49,18.92 16.26,19.68 16.26,21.08 v16.13,21.21
  Bottom 0.61: v16.13,21.21 21.72,21.21 22.48,21.97 U4.P$2
SW  (via drill 0.6)
  Top 0.61: IC1.12 v20.95,27.81 | v23.24,30.1 23.31,30.17 23.18,30.3 | 23.18,30.3 USER.1 USER.2 | C16.2 23.18,30.3
  Bottom 0.61: v20.95,27.81 v23.24,30.1
SW0  (via drill 0.6)
  Top 0.61: ID.2 18.8,7.75 v20.83,9.78 | IC1.6 21.72,20.19 23.88,18.03 v23.88,15.11
  Bottom 0.61: v20.83,9.78 23.88,12.83 v23.88,15.11
SW1
  Top 0.61: IC1.2 20.83,15.11 21.97,13.97 21.97,9.35 20.7,7.96 20.7,4.45 18.8,2.67 18.67,2.54 15.41,2.54 ID.8
SW2
  Top 0.61: IC1.3 20.83,16.38 22.86,14.35 22.86,7.79 ID.4
SW3  (via drill 0.6)
  Top 0.61: IC1.7 21.84,21.46 24.91,18.4 24.91,14.49 v25.04,14.36
  Bottom 0.61: ID.1 24.77,2.67 26.04,3.94 26.04,13.37 v25.04,14.36
VCC_1  (via drill 0.8, 1)
  Top 0.61: 28.57,13.78 v28.57,13.84 28.57,13.21 27.3,13.21 25.4,11.3 25.4,10.05 R2.2
  Top 1.016: C13.1 v34.8,27.05 | C14.1 v34.8,39.24
  other vias: 28.57,17.4 28.57,15.62 33.53,39.24 33.53,27.05
  pour Top (isolate 0.254, rank 2, no thermals): 29.46,18.8 29.46,13.08 27.81,13.08 27.81,18.29 28.32,18.8
  pour Bottom (isolate 0.254, no thermals): 28.19,13.08 27.81,13.46 27.81,18.29 29.72,20.19 29.72,38.61 30.73,39.62 35.05,39.62 35.05,38.86 32,38.86 31.62,38.48 31.62,27.81 32,27.43 35.05,27.43 35.05,26.67 32,26.67 31.62,26.29 31.62,18.29 30.61,17.27 30.61,13.59 30.1,13.08
VDD
  pour Top (isolate 0.254, rank 3, no thermals): 58.17,11.05 33.91,11.05 33.02,11.94 33.02,17.78 34.04,18.8 34.92,18.8 36.2,20.07 36.2,42.55 37.34,43.69 47.5,43.69 47.5,21.97 47.88,21.59 57.4,21.59 59.69,19.3 59.69,12.57

### Text on the board
bPlace: Designed by Shohei